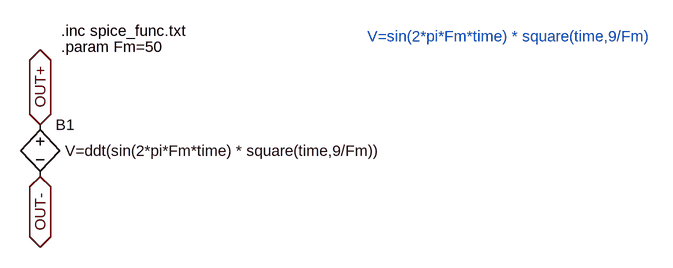
[diagram p0: schematic Signal-generator.asc]
Signal-generator.asc, the LTspice schematic file:
Version 4
SHEET 1 1148 680
FLAG 16 192 OUT-
IOPIN 16 192 BiDir
FLAG 16 112 OUT+
IOPIN 16 112 BiDir
SYMBOL bv 16 96 R0
WINDOW 3 38 56 Left 2
SYMATTR Value V=ddt(sin(2*pi*Fm*time) * square(time,9/Fm))
SYMATTR InstName B1
TEXT 48 -8 Left 2 !.param Fm=50
TEXT 520 -24 Left 2 ;V=sin(2*pi*Fm*time) * square(time,9/Fm)
TEXT 48 -32 Left 2 !.inc spice_func.txt

The netlist it stands for:
* Signal-generator.asc
B1 OUT+ OUT- V=ddt(sin(2*pi*Fm*time) * square(time,9/Fm))
.param Fm=50
* V=sin(2*pi*Fm*time) * square(time,9/Fm)
.inc spice_func.txt
.backanno
.end